# EAGLE design memory_board (EAGLE 7.7.0)
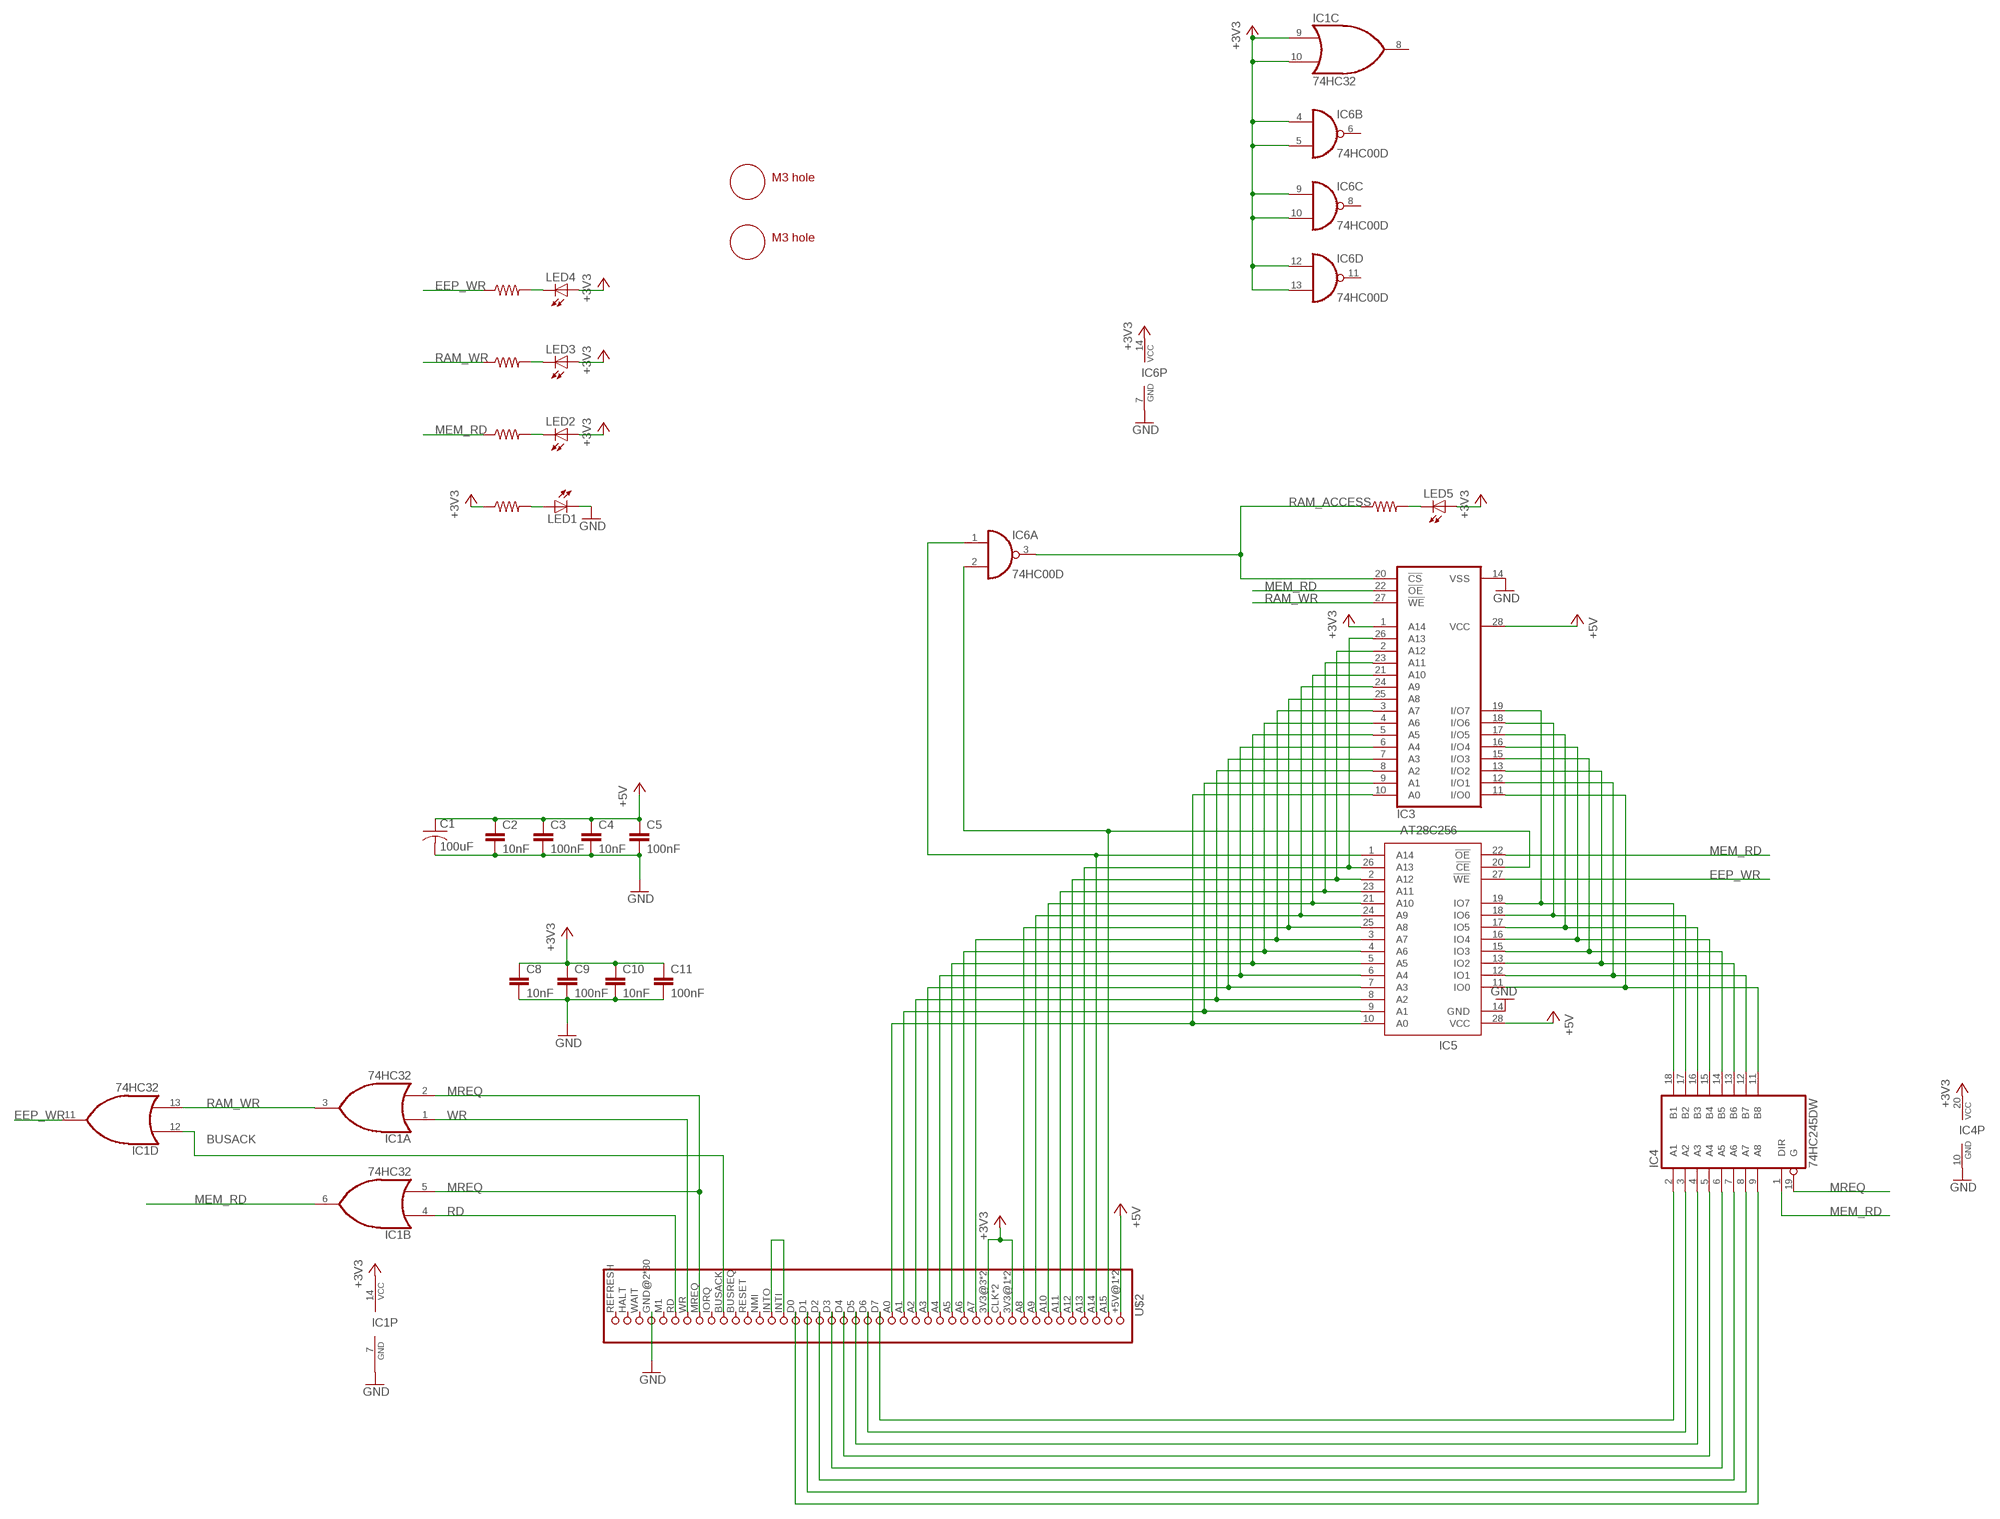
[diagram p0: schematic, sheet 1]

## Parts
C1  100uF  C-USC1210  [C1210]
C2  10nF  22UF-6.3V-20%(0805)  [0805]
C3  100nF  22UF-6.3V-20%(0805)  [0805]
C4  10nF  22UF-6.3V-20%(0805)  [0805]
C5  100nF  22UF-6.3V-20%(0805)  [0805]
C8  10nF  22UF-6.3V-20%(0805)  [0805]
C9  100nF  22UF-6.3V-20%(0805)  [0805]
C10  10nF  22UF-6.3V-20%(0805)  [0805]
C11  100nF  22UF-6.3V-20%(0805)  [0805]
IC1  74HC32  74S32D  [SO14]
IC3  62256P  [DIL28-6]
IC4  74HC245DW  [SO20W]
IC5  AT28C256  [DIL28-6]
IC6  74HC00D  [SO14]
LED1  LEDCHIP-LED0805  [CHIP-LED0805]
LED2  LEDCHIP-LED0805  [CHIP-LED0805]
LED3  LEDCHIP-LED0805  [CHIP-LED0805]
LED4  LEDCHIP-LED0805  [CHIP-LED0805]
LED5  LEDCHIP-LED0805  [CHIP-LED0805]
R1  2K  RESISTOR0805-RES  [0805]
R2  2K  RESISTOR0805-RES  [0805]
R3  2K  RESISTOR0805-RES  [0805]
R7  2K  RESISTOR0805-RES  [0805]
R8  2K  RESISTOR0805-RES  [0805]
U$1  M3_MOUNTING_HOLE  [M3_MOUNTING_HOLE_PACK]
U$2  FAP_BUS  [2X38]
U$3  M3_MOUNTING_HOLE  [M3_MOUNTING_HOLE_PACK]

## Nets
+3V3: C8.1 C9.1 C10.1 C11.1 IC1.9(C:I0) IC1.10(C:I1) IC1.14(P:VCC) IC3.1(A14) IC4.20(VCC) IC6.4(B:I0) IC6.5(B:I1) IC6.9(C:I0) IC6.10(C:I1) IC6.12(D:I0) IC6.13(D:I1) IC6.14(P:VCC) LED2.A LED3.A LED4.A LED5.A R8.1 U$2.3V3@1 U$2.3V3@2 U$2.3V3@3 U$2.3V3@4
+5V: C1.1 C2.1 C3.1 C4.1 C5.1 IC3.28(VCC) IC5.28(VCC) U$2.+5V@1 U$2.+5V@2
BUSACK: IC1.12(D:I0) U$2.BUSACK
EEP_WR: IC1.11(D:O) IC5.27(!WE) R2.1
GND: C1.2 C2.2 C3.2 C4.2 C5.2 C8.2 C9.2 C10.2 C11.2 IC1.7(P:GND) IC3.14(VSS) IC4.10(GND) IC5.14(GND) IC6.7(P:GND) LED1.C U$2.GND@2(GND) U$2.GND@3(GND) U$2.GND@4(GND) U$2.GND@5(GND) U$2.GND@6(GND) U$2.GND@7(GND) U$2.GND@8(GND) U$2.GND@9(GND) U$2.GND@13(GND) U$2.GND@14(GND) U$2.GND@15(GND) U$2.GND@16(GND) U$2.GND@17(GND) U$2.GND@18(GND) U$2.GND@19(GND) U$2.GND@20(GND) U$2.GND@21(GND) U$2.GND@22(GND) U$2.GND@23(GND) U$2.GND@24(GND) U$2.GND@25(GND) U$2.GND@26(GND) U$2.GND@27(GND) U$2.GND@28(GND) U$2.GND@30(GND) U$2.GND@34(GND) U$2.GND@35(GND) U$2.GND@36(GND) U$2.GND@37(GND) U$2.GND@38(GND)
MEM_RD: IC1.6(B:O) IC3.22(!OE) IC4.1(DIR) IC5.22(!OE) R7.1
MREQ: IC1.2(A:I1) IC1.5(B:I1) IC4.19(G) U$2.MREQ
N$1: IC3.19(I/O7) IC4.18(B1) IC5.19(IO7)
N$2: IC3.18(I/O6) IC4.17(B2) IC5.18(IO6)
N$3: IC3.17(I/O5) IC4.16(B3) IC5.17(IO5)
N$4: IC3.16(I/O4) IC4.15(B4) IC5.16(IO4)
N$5: IC3.15(I/O3) IC4.14(B5) IC5.15(IO3)
N$6: IC3.13(I/O2) IC4.13(B6) IC5.13(IO2)
N$7: IC3.12(I/O1) IC4.12(B7) IC5.12(IO1)
N$8: IC3.11(I/O0) IC4.11(B8) IC5.11(IO0)
N$9: IC5.1(A14) IC6.1(A:I0) U$2.A14
N$10: IC3.26(A13) IC5.26(A13) U$2.A13
N$11: IC3.2(A12) IC5.2(A12) U$2.A12
N$12: IC3.23(A11) IC5.23(A11) U$2.A11
N$13: IC3.21(A10) IC5.21(A10) U$2.A10
N$14: IC3.24(A9) IC5.24(A9) U$2.A9
N$15: IC3.25(A8) IC5.25(A8) U$2.A8
N$16: IC3.3(A7) IC5.3(A7) U$2.A7
N$17: IC3.4(A6) IC5.4(A6) U$2.A6
N$18: IC3.5(A5) IC5.5(A5) U$2.A5
N$19: IC3.6(A4) IC5.6(A4) U$2.A4
N$20: IC3.7(A3) IC5.7(A3) U$2.A3
N$21: IC3.8(A2) IC5.8(A2) U$2.A2
N$22: IC3.9(A1) IC5.9(A1) U$2.A1
N$23: IC3.10(A0) IC5.10(A0) U$2.A0
N$24: IC4.9(A8) U$2.D0
N$25: IC4.8(A7) U$2.D1
N$26: IC4.7(A6) U$2.D2
N$27: IC4.6(A5) U$2.D3
N$28: IC4.5(A4) U$2.D4
N$29: IC4.4(A3) U$2.D5
N$30: IC4.3(A2) U$2.D6
N$31: IC4.2(A1) U$2.D7
N$32: IC5.20(!CE) IC6.2(A:I1) U$2.A15
N$33: U$2.INTI U$2.INTO
N$34: LED2.C R7.2
N$35: LED3.C R1.2
N$36: LED4.C R2.2
N$37: LED5.C R3.2
N$82: LED1.A R8.2
RAM_ACCESS: IC3.20(!CS) IC6.3(A:O) R3.1
RAM_WR: IC1.3(A:O) IC1.13(D:I1) IC3.27(!WE) R1.1
RD: IC1.4(B:I0) U$2.RD
WR: IC1.1(A:I0) U$2.WR
Unconnected: IC1.8(C:O) IC6.6(B:O) IC6.8(C:O) IC6.11(D:O) U$2.BUSREQ U$2.CLK U$2.CLK@2 U$2.HALT U$2.IORQ U$2.M1 U$2.NMI U$2.REFRESH U$2.RESET U$2.WAIT

## Library data of the parts
C1 = adafruit:C-US: CAPACITOR, American symbol
C2-C5 C8-C11 = SparkFun-Capacitors:22UF-6.3V-20%(0805): CAP-08402 Ceramic; PROD_ID: CAP-08402; VALUE: 22uF
IC1 = 74xx-us:74*32: Quad 2-input OR gate
IC3 = memory-hitachi:62256P: MEMORY; OC_FARNELL: unknown; OC_NEWARK: unknown
IC4 = 74xx-eu:74*245: Octal BUS TRANSCEIVER, 3-state
IC5 = bt_memory:AT28C256: EEPROM 32Kx8 256k bit The AT28C256 is a high-performance Electrically Erasable and Programmable Read Only Memory. Its 256K of memory is organized as 32,768 words by 8 bits.
IC6 = 74xx-eu:74*00: Quad 2-input NAND gate
LED1-LED5 = adafruit:LED: LED OSRAM: - CHIPLED LG R971, LG N971, LY N971, LG Q971, LY Q971, LO R971, LY R971 LH N974, LH R974 LS Q976, LO Q976, LY Q976 LO Q996 - Hyper CHIPLED LW Q18S LB Q993, LB Q99A, LB R99A - SideLED LS A670, LO A670, LY A670, LG A670, LP A670 LB A673, LV A673, LT A673, LW A673 LH A674 LY A675 LS A676, LA A676, LO A676, LY A676, LW A676 LS A679, LY A679, LG A679 - Hyper Micro SIDELED® LS Y876, LA Y876, LO Y876, LY Y876 LT Y87S - SmartLED LW L88C, LW L88S LB L89C, LB L89S, LG L890 LS L89K, LO L89K, LY L89K LS L896, LA L896, LO L896, LY L896 - TOPLED LS T670, LO T670, LY T670, LG T670, LP T670 LSG T670, LSP T670, LSY T670, LOP T670, LYG T670 LG T671, LOG T671, LSG T671 LB T673, LV T673, LT T673, LW T673 LH T674 LS T676, LA T676, LO T676, LY T676, LB T676, LH T676, LSB T676, LW T676 LB T67C, LV T67C, LT T67C, LS T67K, LO T67K, LY T67K, LW E67C LS E67B, LA E67B, LO E67B, LY E67B, LB E67C, LV E67C, LT E67C LW T67C LS T679, LY T679, LG T679 LS T770, LO T770, LY T770, LG T770, LP T770 LB T773, LV T773, LT T773, LW T773 LH T774 LS E675, LA E675, LY E675, LS T675 LS T776, LA T776, LO T776, LY T776, LB T776 LHGB T686 LT T68C, LB T68C - Hyper Mini TOPLED® LB M676 - Mini TOPLED Santana® LG M470 LS M47K, LO M47K, LY M47K Source: http://www.osram.convergy.de/
R1-R3 R7 R8 = SparkFun-Passives:RESISTOR: Resistor Basic schematic elements and footprints for 0603, 1206, and PTH resistors.
U$1 U$3 = m3_mounting_hole:M3_MOUNTING_HOLE
U$2 = fap_bus:FAP_BUS

## Board
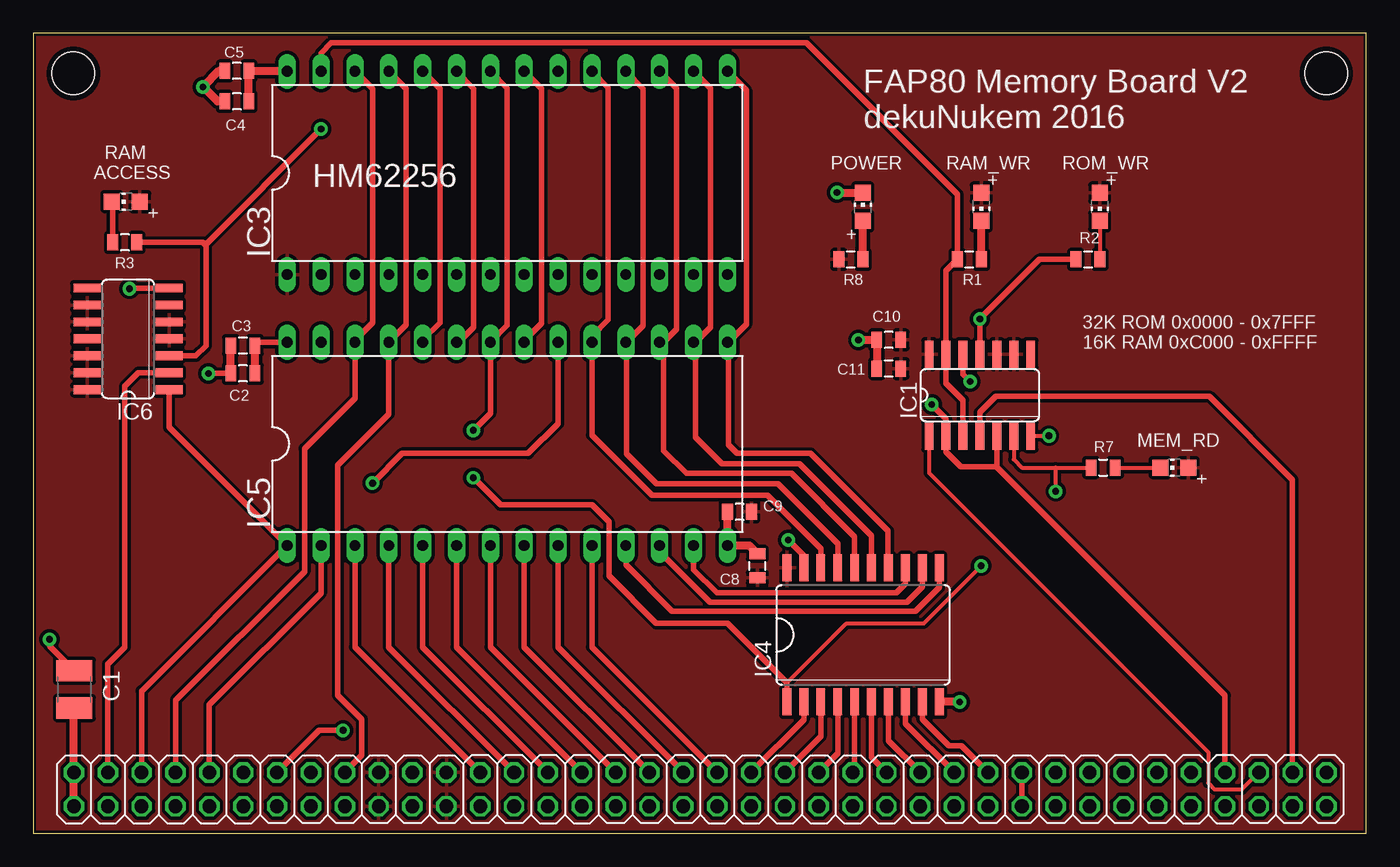
[diagram p1: board, top side]
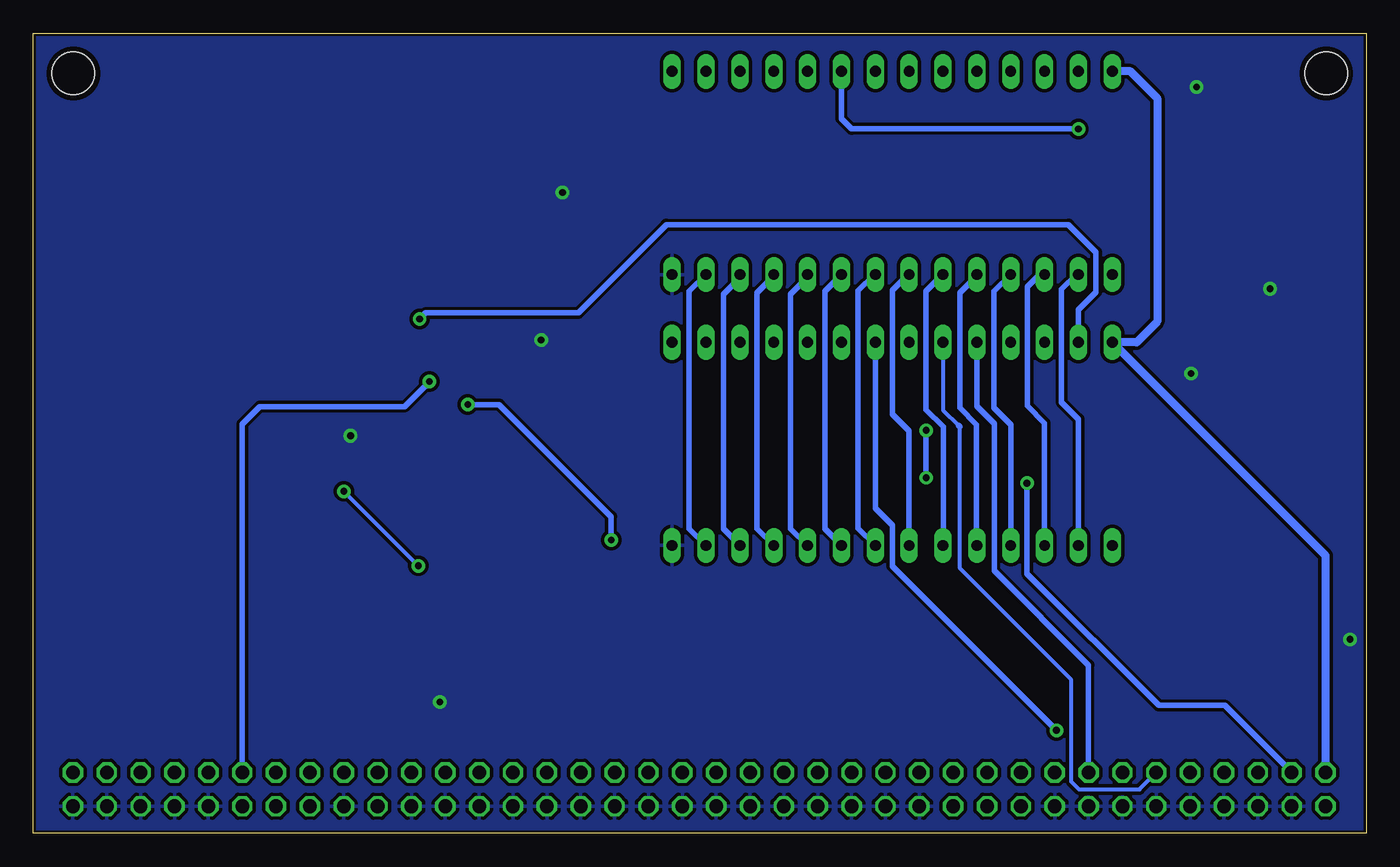
[diagram p2: board, bottom side, seen from below]

Size 100 x 60 mm. Coordinates in mm from the lower left corner, seen from the top.
Outline: 0,0 100,0 100,60 0,60 0,0
Copper layers (1*16): Top 0.035mm / dielectric 1.5mm / Bottom 0.035mm
Design rules "SparkFun-2-layer-STANDARD": minimum track width 10mil, minimum drill 20mil, track to track 10mil, track to pad 8mil, pad to pad 8mil, via to via 10mil, smd to smd 8mil, copper to edge 8mil, drill to drill 8mil, minimum pad ring 10mil, minimum via ring 10mil, stop-mask expansion 4mil, vias tented up to drill 25mil, thermal gap 10mil

### Footprints (pad centres in the part's own frame; a part is rotated, then mirrored left to right if it is on the bottom)
C1210 = smd 1.6 x 2.7: 1 -1.4,0; 2 1.4,0
0805 = smd 0.8 x 1.2: 1 -0.9,0; 2 0.9,0
SO14 = smd 0.66 x 2.032: 1 -3.81,-3.073; 2 -2.54,-3.073; 3 -1.27,-3.073; 4 0,-3.073; 5 1.27,-3.073; 6 2.54,-3.073; 7 3.81,-3.073; 8 3.81,3.073; 9 2.54,3.073; 10 1.27,3.073; 11 0,3.073; 12 -1.27,3.073; 13 -2.54,3.073; 14 -3.81,3.073
DIL28-6 = drill 0.813 long: 1 -16.51,-7.62; 2 -13.97,-7.62; 3 -11.43,-7.62; 4 -8.89,-7.62; 5 -6.35,-7.62; 6 -3.81,-7.62; 7 -1.27,-7.62; 8 1.27,-7.62; 9 3.81,-7.62; 10 6.35,-7.62; 11 8.89,-7.62; 12 11.43,-7.62; 13 13.97,-7.62; 14 16.51,-7.62; 15 16.51,7.62; 16 13.97,7.62; 17 11.43,7.62; 18 8.89,7.62; 19 6.35,7.62; 20 3.81,7.62; 21 1.27,7.62; 22 -1.27,7.62; 23 -3.81,7.62; 24 -6.35,7.62; 25 -8.89,7.62; 26 -11.43,7.62; 27 -13.97,7.62; 28 -16.51,7.62
SO20W = smd 0.66 x 2.032: 1 -5.715,-5.029; 2 -4.445,-5.029; 3 -3.175,-5.029; 4 -1.905,-5.029; 5 -0.635,-5.029; 6 0.635,-5.029; 7 1.905,-5.029; 8 3.175,-5.029; 9 4.445,-5.029; 10 5.715,-5.029; 11 5.715,5.029; 12 4.445,5.029; 13 3.175,5.029; 14 1.905,5.029; 15 0.635,5.029; 16 -0.635,5.029; 17 -1.905,5.029; 18 -3.175,5.029; 19 -4.445,5.029; 20 -5.715,5.029
CHIP-LED0805 = smd 1.2 x 1.2: A 0,-1.05; C 0,1.05
M3_MOUNTING_HOLE_PACK = hole 3.2: 0,0
2X38 = drill 1.016 octagon: 3V3@1 -6.35,0; 3V3@2 -6.35,2.54; 3V3@3 -1.27,0; 3V3@4 -1.27,2.54; +5V@1 -29.21,2.54; +5V@2 -29.21,0; A0 19.05,2.54; A1 16.51,2.54; A2 13.97,2.54; A3 11.43,2.54; A4 8.89,2.54; A5 6.35,2.54; A6 3.81,2.54; A7 1.27,2.54; A8 -8.89,2.54; A9 -11.43,2.54; A10 -13.97,2.54; A11 -16.51,2.54; A12 -19.05,2.54; A13 -21.59,2.54; A14 -24.13,2.54; A15 -26.67,2.54; BUSACK 52.07,2.54; BUSREQ 49.53,2.54; CLK -3.81,2.54; CLK@2 -3.81,0; D0 39.37,2.54; D1 36.83,2.54; D2 34.29,2.54; D3 31.75,2.54; D4 29.21,2.54; D5 26.67,2.54; D6 24.13,2.54; D7 21.59,2.54; GND@2 -26.67,0; GND@3 -24.13,0; GND@4 -21.59,0; GND@5 -19.05,0; GND@6 -16.51,0; GND@7 -13.97,0; GND@8 -11.43,0; GND@9 -8.89,0; GND@13 1.27,0; GND@14 3.81,0; GND@15 6.35,0; GND@16 8.89,0; GND@17 11.43,0; GND@18 13.97,0; GND@19 16.51,0; GND@20 19.05,0; GND@21 21.59,0; GND@22 24.13,0; GND@23 26.67,0; GND@24 29.21,0; GND@25 31.75,0; GND@26 34.29,0; GND@27 36.83,0; GND@28 39.37,0; GND@30 44.45,0; GND@34 54.61,0; GND@35 57.15,0; GND@36 59.69,0; GND@37 62.23,0; GND@38 64.77,0; HALT 52.07,0; INTI 41.91,0; INTO 41.91,2.54; IORQ 54.61,2.54; M1 64.77,2.54; MREQ 57.15,2.54; NMI 44.45,2.54; RD 62.23,2.54; REFRESH 46.99,0; RESET 46.99,2.54; WAIT 49.53,0; WR 59.69,2.54

### Placement (x,y rotation side)
C1  3.07,10.79 90 top
C2  15.72,34.49 180 top
C3  15.72,36.58 180 top
C4  15.27,54.89 180 top
C5  15.27,57.18 180 top
C8  54.33,20.07 90 top
C9  52.98,24.1 180 top
C10  64.19,37.01 180 top
C11  64.19,34.85 180 top
IC1  71.02,32.87 0 top
IC3  35.56,49.53 0 top
IC4  62.26,14.88 0 top
IC5  35.56,29.21 0 top
IC6  7.11,37.08 90 top
LED1  62.23,46.99 0 top
LED2  85.6,27.43 90 top
LED3  71.12,46.99 180 top
LED4  80.01,46.99 180 top
LED5  6.93,47.37 90 top
R1  70.23,43.05 0 top
R2  79.12,43.05 0 top
R3  6.86,44.32 180 top
R7  80.26,27.43 0 top
R8  61.34,43.05 0 top
U$1  3,57 0 top
U$2  32.26,2.03 0 top
U$3  97,57 0 top

### Tracks (layer width: path | path; a pad name or v marks a point on that pad's centre or on a via)
+3V3
  pour Top: 0,60.96 100.33,60.96 100.33,0 0,0
+5V
  Top 0.406: C3.1 16.88,36.83 IC5.28
  Top 0.61: U$2.+5V@2 U$2.+5V@1 3.05,9.37 C1.1 | IC3.28 19.02,57.17 C5.1 C4.1 | C3.1 C2.1
  Bottom 0.61: 18.54,36.83 IC5.28 | U$2.+5V@1 3.05,20.83 IC5.28 | IC3.28 17.68,57.15 15.67,55.14 15.67,38.38 17.22,36.83 IC5.28
BUSACK  (via drill 0.5)
  Top 0.406: IC1.12 69.75,34.42 v70.28,33.88
  Bottom 0.406: v70.28,33.88 72.16,32 83.01,32 84.33,30.68 U$2.BUSACK
EEP_WR  (via drill 0.5)
  Top 0.406: IC1.11 v71.02,38.58 75.49,43.05 R2.1
  Bottom 0.406: IC5.27 21.59,39.27 20.27,40.59 20.27,43.59 22.33,45.64 52.5,45.64 59.11,39.04 70.56,39.04 v71.02,38.58
GND  (via drill 0.51)
  Top 0.305: v76.2,29.82 76.17,29.79 IC1.7
  Top 0.406: IC6.7 7.26,40.89 v7.21,40.84 | v13.13,34.49 C2.2 | v1.22,14.55 1.22,14.05 C1.2
  Top 0.61: v69.49,9.86 IC4.10 | C5.2 13.92,57.17 v12.72,55.98 13.82,54.89 C4.2 | C2.2 C3.2 | v61.9,37.01 C10.2 C11.2 | C9.2 IC5.14 53.71,21.59 C8.2 | 62.26,48.06 LED1.C 62.21,48.06 v60.3,48.06
  pour Bottom: 0,60.96 100.33,60.96 100.33,0 0,0
MEM_RD  (via drill 0.5)
  Top 0.305: IC1.6 73.56,28.04 74.17,27.43 76.71,27.43 | 76.71,27.43 R7.1 | 56.54,11.28 61.01,15.75 66.8,15.75 v71.12,20.07 | v76.71,25.65 76.71,27.43
  Top 0.406: IC3.22 35.56,55.88 35.56,38.1 IC5.22 34.29,31.5 v33.02,30.23 | v33.02,26.67 35.05,24.64 41.91,24.64 43.18,23.37 43.18,19.3 46.74,15.75 52.07,15.75 56.54,11.28 IC4.1
  Bottom 0.305: v71.12,20.07 v76.71,25.65
  Bottom 0.406: v33.02,30.23 v33.02,26.67
MREQ  (via drill 0.5)
  Top 0.406: 72.29,27.46 IC1.5 | IC4.19 57.81,20.83 v56.64,22 | v67.41,32.16 68.48,31.09 IC1.2 68.48,28.6 69.6,27.48 72.26,27.48 72.29,27.46 | U$2.MREQ 89.41,10.34 72.36,27.38 72.29,27.46
  Bottom 0.406: v56.64,22 56.64,23.75 65.05,32.16 v67.41,32.16
N$1
  Top 0.406: IC3.19 43.13,55.93 43.13,38.51 41.91,37.29 IC5.19 41.91,29.87 46.43,25.35 55.09,25.35 59.08,21.36 IC4.18
N$2
  Top 0.406: IC3.18 45.74,55.85 45.74,38.08 44.5,36.83 | 44.5,36.83 IC5.18 | 44.5,36.83 44.5,28.47 46.76,26.21 55.85,26.21 60.35,21.72 IC4.17
N$3
  Top 0.406: IC3.17 48.26,55.88 48.26,37.8 47.3,36.83 | 47.3,36.83 IC5.17 | 47.3,36.83 47.3,28.7 49,27 56.87,27 61.62,22.25 IC4.16
N$4
  Top 0.406: IC3.16 50.8,55.88 50.8,37.95 49.68,36.83 | 49.68,36.83 IC5.16 | 49.68,36.83 49.68,29.72 51.66,27.74 57.48,27.74 62.89,22.33 IC4.15
N$5
  Top 0.406: IC3.15 53.49,55.73 53.49,38.18 52.15,36.83 | 52.15,36.83 IC5.15 | 52.15,36.83 52.15,29.13 52.78,28.5 58.32,28.5 64.14,22.68 64.14,19.94 IC4.14
N$6
  Top 0.406: IC5.13 49.53,19.79 51.28,18.03 64.75,18.03 65.43,18.72 IC4.13
  Bottom 0.406: IC5.13 50.8,22.86 50.8,40.64 IC3.13
N$7
  Top 0.406: IC5.12 46.99,21.11 50.77,17.32 65.53,17.32 66.7,18.49 IC4.12
  Bottom 0.406: IC5.12 48.23,22.84 48.23,40.44 46.99,41.68 IC3.12
N$8
  Top 0.406: IC5.11 44.45,20.14 47.93,16.66 66.19,16.66 67.97,18.44 IC4.11
  Bottom 0.406: IC5.11 45.72,22.86 45.72,40.54 44.45,41.81 IC3.11
N$9
  Top 0.406: U$2.A14 8.13,10.67 IC5.1 10.19,30.45 IC6.1
N$10
  Top 0.406: IC3.26 25.45,55.83 25.45,38.3 24.13,36.98 IC5.26 24.13,32.64 20.34,28.85 20.34,19.63 10.69,9.98 10.69,4.6 U$2.A13
N$11
  Top 0.406: IC5.2 21.59,18.01 13.21,9.63 U$2.A12
  Bottom 0.406: IC3.2 21.74,41.91 22.86,40.79 22.86,32.33 21.59,31.06 IC5.2
N$12
  Top 0.406: IC3.23 33.05,55.85 33.05,37.97 31.9,36.83 IC5.23
  Bottom 0.305: IC5.23 31.75,31.75 30.59,30.59 | U$2.A11 17.02,3.3 21.54,3.3 22.12,3.89 22.12,11.51 30.48,19.86 30.48,30.48
  Bottom 0.406: 30.48,30.48 30.59,30.59
N$13  (via drill 0.51)
  Top 0.406: IC3.21 38.12,55.85 38.12,38.25 36.83,36.96 IC5.21 | v23.24,7.72 21.44,7.72 U$2.A10
  Bottom 0.406: IC5.21 36.83,24.38 35.56,23.11 35.56,20.04 v23.24,7.72
N$14
  Top 0.406: IC3.24 30.5,55.85 30.5,38.3 29.21,37.01 IC5.24
  Bottom 0.406: U$2.A9 20.83,12.62 27.89,19.68 27.89,30.71 29.21,32.03 IC5.24
N$15
  Top 0.406: IC3.25 27.96,55.85 27.96,38.12 IC5.25 26.67,31.45 22.84,27.61 22.84,10.36 24.64,8.56 24.64,5.84 U$2.A8
N$16
  Top 0.406: IC5.3 24.13,13.97 U$2.A7
  Bottom 0.406: IC3.3 24.51,41.91 25.43,41 25.43,32.05 24.13,30.76 IC5.3
N$17
  Top 0.406: IC5.4 26.67,13.97 U$2.A6
  Bottom 0.406: IC3.4 27.94,40.64 27.94,31.9 26.67,30.63 IC5.4
N$18
  Top 0.406: IC5.5 29.21,13.97 U$2.A5
  Bottom 0.406: IC3.5 29.21,41.81 30.48,40.54 30.48,31.9 29.23,30.66 29.23,21.61 IC5.5
N$19
  Top 0.406: IC5.6 31.75,13.97 U$2.A4
  Bottom 0.406: IC3.6 31.77,41.91 33.02,40.66 33.02,31.77 31.73,30.48 31.73,21.61 IC5.6
N$20
  Top 0.406: IC5.7 34.29,13.97 U$2.A3
  Bottom 0.406: IC3.7 34.37,41.91 35.56,40.72 35.56,31.45 34.29,30.18 IC5.7
N$21
  Top 0.406: IC5.8 36.83,13.97 U$2.A2
  Bottom 0.406: IC5.8 38.12,22.89 38.12,40.69 36.91,41.91 IC3.8
N$22
  Top 0.406: IC5.9 39.37,13.97 U$2.A1
  Bottom 0.406: IC5.9 40.62,22.84 40.62,40.66 IC3.9
N$23
  Top 0.406: IC5.10 41.91,13.97 U$2.A0
  Bottom 0.406: IC5.10 43.18,22.86 43.18,40.44 41.91,41.71 IC3.10
N$24
  Top 0.406: IC4.9 66.7,8.56 68.68,6.58 69.62,6.58 U$2.D0
N$25
  Top 0.406: IC4.8 65.43,8.23 U$2.D1
N$26
  Top 0.406: IC4.7 64.16,6.96 U$2.D2
N$27
  Top 0.406: IC4.6 62.89,5.69 U$2.D3
N$28
  Top 0.406: IC4.5 61.62,4.72 U$2.D4
N$29
  Top 0.406: IC4.4 60.35,5.99 U$2.D5
N$30
  Top 0.406: IC4.3 59.08,7.26 U$2.D6
N$31
  Top 0.406: IC4.2 57.81,8.53 U$2.D7
N$32  (via drill 0.51)
  Top 0.406: IC5.20 39.37,30.73 37.13,28.5 27.69,28.5 v25.45,26.26 | IC6.2 7.87,34.54 6.86,33.53 6.86,13.97 5.59,12.7 U$2.A15
  Bottom 0.406: U$2.A15 10.62,9.6 15.57,9.6 25.45,19.48 v25.45,26.26
N$33
  Top 0.406: U$2.INTO U$2.INTI
N$34
  Top 0.305: R7.2 LED2.C
N$35
  Top 0.61: R1.2 LED3.C
N$36
  Top 0.305: LED4.C 80.02,45.93 R2.2
N$37
  Top 0.406: R3.2 5.96,47.3 LED5.C
N$82
  Top 0.61: R8.2 LED1.A
RAM_ACCESS  (via drill 0.5)
  Top 0.406: IC6.3 12.19,35.81 12.95,36.58 12.95,44.07 | 12.95,44.07 12.95,44.2 v21.59,52.83 | R3.1 12.7,44.32 12.95,44.07
  Bottom 0.406: v21.59,52.83 38.61,52.83 39.37,53.59 IC3.20
RAM_WR
  Top 0.406: IC1.3 69.75,32.49 68.48,33.76 IC1.13 68.48,42.2 R1.1 69.34,43.06 69.34,47.93 57.99,59.28 22.35,59.28 21.59,58.52 IC3.27
RD
  Top 0.406: IC1.4 71.02,31.57 72.21,32.77 88.21,32.77 94.46,26.52 94.46,4.6 U$2.RD
WR
  Top 0.305: IC1.1 67.21,27.03 88.14,6.1 88.14,3.79 88.62,3.3 90.68,3.3 U$2.WR

### Text on the board
tNames: FAP80 Memory Board V2 / dekuNukem 2016 | POWER | RAM_WR | ROM_WR | RAM / ACCESS | HM62256 | 32K ROM 0x0000 - 0x7FFF / 16K RAM 0xC000 - 0xFFFF | MEM_RD